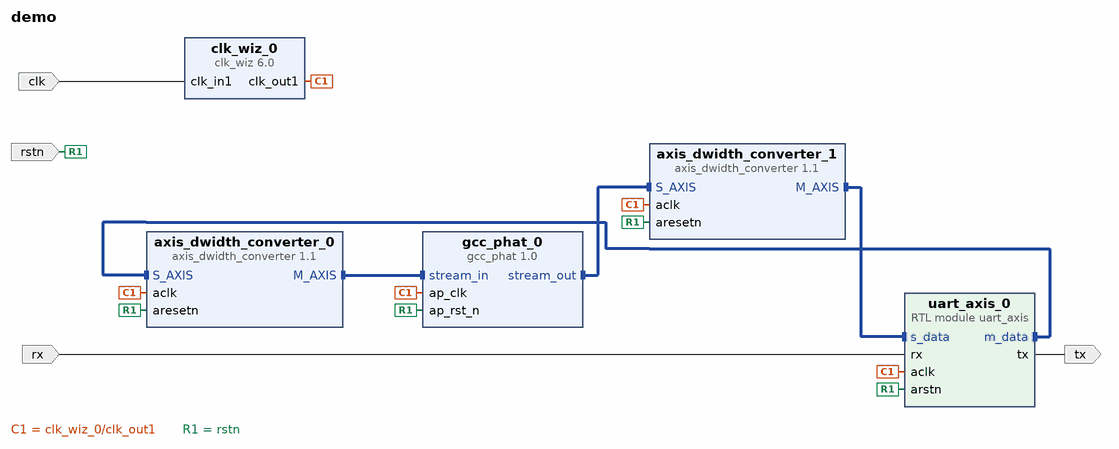
[diagram p0: block diagram of the top level]
# Vivado block design demo, xc7s50csga324-1, Vivado 2025.1
create_bd_design demo

create_bd_port -dir I -type data rx
create_bd_port -dir I -type rst rstn
set_property -dict {CONFIG.POLARITY ACTIVE_LOW} [get_bd_ports rstn]
create_bd_port -dir O -type data tx
create_bd_port -dir I -type clk clk
set_property -dict {CONFIG.ASSOCIATED_RESET rstn CONFIG.FREQ_HZ 100000000} [get_bd_ports clk]

create_bd_cell -type module -reference uart_axis uart_axis_0
set_property -dict {CONFIG.DIVIDER 33 CONFIG.DIVIDER_WIDTH 6} [get_bd_cells uart_axis_0]
create_bd_cell -type ip -vlnv polsl:gcc_internal:gcc_phat:1.0 gcc_phat_0
create_bd_cell -type ip -vlnv xilinx.com:ip:axis_dwidth_converter:1.1 axis_dwidth_converter_0
set_property -dict {CONFIG.M_TDATA_NUM_BYTES 8} [get_bd_cells axis_dwidth_converter_0]
create_bd_cell -type ip -vlnv xilinx.com:ip:axis_dwidth_converter:1.1 axis_dwidth_converter_1
set_property -dict {CONFIG.M_TDATA_NUM_BYTES 1 CONFIG.S_TDATA_NUM_BYTES 6} [get_bd_cells axis_dwidth_converter_1]
create_bd_cell -type ip -vlnv xilinx.com:ip:clk_wiz:6.0 clk_wiz_0
set_property -dict [list \
  CONFIG.CLKIN1_JITTER_PS 250 \
  CONFIG.CLKIN1_UI_JITTER 250 \
  CONFIG.CLKIN2_JITTER_PS 100.000 \
  CONFIG.CLKIN2_UI_JITTER 100.000 \
  CONFIG.CLKOUT1_DRIVES BUFG \
  CONFIG.CLKOUT1_JITTER 171.089 \
  CONFIG.CLKOUT1_PHASE_ERROR 98.575 \
  CONFIG.CLKOUT1_REQUESTED_OUT_FREQ 100 \
  CONFIG.CLKOUT2_DRIVES BUFG \
  CONFIG.CLKOUT3_DRIVES BUFG \
  CONFIG.CLKOUT4_DRIVES BUFG \
  CONFIG.CLKOUT5_DRIVES BUFG \
  CONFIG.CLKOUT6_DRIVES BUFG \
  CONFIG.CLKOUT7_DRIVES BUFG \
  CONFIG.FEEDBACK_SOURCE FDBK_AUTO \
  CONFIG.JITTER_OPTIONS PS \
  CONFIG.MMCM_BANDWIDTH OPTIMIZED \
  CONFIG.MMCM_CLKFBOUT_MULT_F 10.000 \
  CONFIG.MMCM_CLKOUT0_DIVIDE_F 10.000 \
  CONFIG.MMCM_COMPENSATION ZHOLD \
  CONFIG.MMCM_REF_JITTER1 0.025 \
  CONFIG.MMCM_REF_JITTER2 0.010 \
  CONFIG.PRIMITIVE MMCM \
  CONFIG.USE_LOCKED false \
  CONFIG.USE_RESET false \
] [get_bd_cells clk_wiz_0]

# ---- connections ----

connect_bd_intf_net [get_bd_intf_pins axis_dwidth_converter_0/M_AXIS] [get_bd_intf_pins gcc_phat_0/stream_in]
connect_bd_intf_net [get_bd_intf_pins axis_dwidth_converter_1/M_AXIS] [get_bd_intf_pins uart_axis_0/s_data]
connect_bd_intf_net [get_bd_intf_pins axis_dwidth_converter_1/S_AXIS] [get_bd_intf_pins gcc_phat_0/stream_out]
connect_bd_intf_net [get_bd_intf_pins axis_dwidth_converter_0/S_AXIS] [get_bd_intf_pins uart_axis_0/m_data]
connect_bd_net [get_bd_ports clk] [get_bd_pins clk_wiz_0/clk_in1]
connect_bd_net [get_bd_pins clk_wiz_0/clk_out1] \
  [get_bd_pins axis_dwidth_converter_0/aclk] [get_bd_pins axis_dwidth_converter_1/aclk] [get_bd_pins uart_axis_0/aclk] \
  [get_bd_pins gcc_phat_0/ap_clk]
connect_bd_net -net rst_1 [get_bd_ports rstn] \
  [get_bd_pins axis_dwidth_converter_0/aresetn] [get_bd_pins axis_dwidth_converter_1/aresetn] [get_bd_pins uart_axis_0/arstn] \
  [get_bd_pins gcc_phat_0/ap_rst_n]
connect_bd_net [get_bd_ports rx] [get_bd_pins uart_axis_0/rx]
connect_bd_net [get_bd_pins uart_axis_0/tx] [get_bd_ports tx]

validate_bd_design
save_bd_design
